# Altium schematic sheet ME2_LNA.SchDoc
size A; SheetNumber: 1; SheetTotal: 1
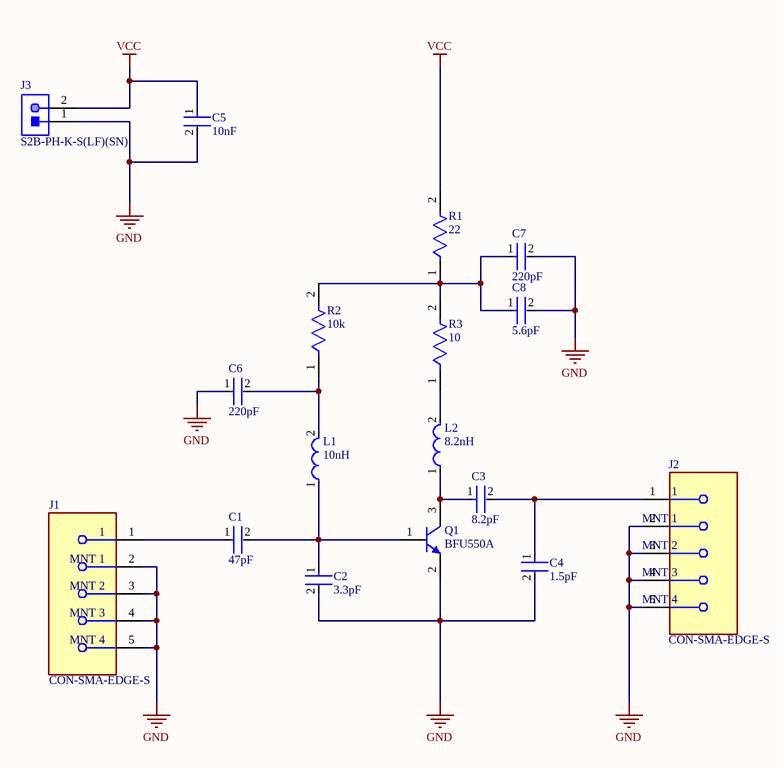
[diagram p0: ME2_LNA.SchDoc]

## Parts
C1  47pF  [FP-GCM188-0_1-MFG]
C2  3.3pF  [FP-GCM188-0_1-MFG]
C3  8.2pF  [FP-GCM188-0_1-MFG]
C4  1.5pF  [FP-GCM188-0_1-MFG]
C5  10nF  [FP-C0603C-CF-MFG]
C6  220pF  [FP-GCM188-0_1-MFG]
C7  220pF  [FP-GCM188-0_1-MFG]
C8  5.6pF  [FP-GCM188-0_1-MFG]
J1  CON-SMA-EDGE-S  [FP-CON-SMA-EDGE-S-MFG]
J2  CON-SMA-EDGE-S  [FP-CON-SMA-EDGE-S-MFG]
J3  S2B-PH-K-S(LF)(SN)  [JST-S2B-PH-K-S_V]
L1  10nH  [FP-LQW18AN_00-MFG]
L2  8.2nH  [FP-LQW18AN_00-MFG]
Q1  BFU550A  [ONSC-SOT-23-3-318-08_V]
R1  22  [FP-CRCW0603-e3-MFG]
R2  10k  [FP-CRCW0603-HPe3-MFG]
R3  10  [FP-CRCW0603-e3-MFG]

## Nets
GND: C2.2 C4.2 C5.2 C6.1 C7.2 C8.2 J1.2(MNT_1) J1.3(MNT_2) J1.4(MNT_3) J1.5(MNT_4) J2.2(MNT_1) J2.3(MNT_2) J2.4(MNT_3) J2.5(MNT_4) J3.1 Q1.2(E)
VCC: C5.1 J3.2 R1.2
NetC1_1: C1.1 J1.1
NetC1_2: C1.2 C2.1 L1.1 Q1.1(B)
NetC3_1: C3.1 L2.1 Q1.3(C)
NetC3_2: C3.2 C4.1 J2.1
NetC6_2: C6.2 L1.2 R2.1
NetC7_1: C7.1 C8.1 R1.1 R2.2 R3.2
NetL2_2: L2.2 R3.1

## Library data of the parts
C1 = CMP-06035-035791-1: Ceramic Capacitor for Automotive 47pF  ±1% 100VDC C0G 0603 Paper T/R / GCM1885C2A470FA16D; Voltage Rating: 100V; Ratings: AEC-Q200; Case Code (Metric): 1608; Case Code (Imperial): 0603; Capacitance: 47pF; Min Operating Temperature: -55°C; Case/Package: 0603; Tolerance: 1%; Packaging: Cut Tape; Max Operating Temperature: 125°C; Mount: Surface Mount
C2 = CMP-06035-045493-1: Ceramic Capacitor for Automotive 3.3pF  ±0.25pF 100VDC C0G 0603 Paper T/R / GCM1885C2A3R3CA16D; Voltage Rating (DC): 100V; Max Operating Temperature: 125°C; Height: 0.8mm; Package Quantity: 4000; Weight: 0.000222oz; Width: 0.8mm; Case Code (Imperial): 0603; Thickness: 0.035inch; Case Code (Metric): 1608; Length: 0.063inch; Packaging: Tape and Reel; Termination: SMD/SMT; Ratings: AEC-Q200; Mount: Surface Mount; Case/Package: 0603; Capacitance: 3.3pF; Dielectric: C0G; Voltage Rating: 100V; Min Operating Temperature: -55°C
C3 = CMP-06035-009251-1: Ceramic Capacitor for Automotive 8.2pF  ±0.25pF 100VDC C0G 0603 Paper T/R / GCM1885C2A8R2CA16D
C4 = CMP-06035-055355-1: Ceramic Capacitor for Automotive 1.5pF  ±0.25pF 100VDC C0G 0603 Paper T/R / GCM1885C2A1R5CA16D; Voltage Rating (DC): 100V; Thickness: 0.035inch; Packaging: Tape and Reel; Weight: 0.000222oz; Length: 0.063inch; Min Operating Temperature: -55°C; Case/Package: 0603; Termination: SMD/SMT; Package Quantity: 4000; Case Code (Metric): 1608; Ratings: AEC-Q200; Max Operating Temperature: 125°C; Height: 0.8mm; Case Code (Imperial): 0603; Capacitance: 1.5pF; Mount: Surface Mount; Dielectric: C0G; Width: 0.8mm; Voltage Rating: 100V
C5 = CMP-2006-03038-2: CAP CER 10000PF 200V X7R 0603 / C0603C103K2RACTU; Manufacturer: KEMET; Material: Ceramic; Value: 10,000 pF; Temperature Coefficient: 30ppm/°C; Tolerance: 0.1; Automotive Grade: Grade 1; Voltage Rating: 200 V; Manufacturer Part Number: C0603C103K2RACTU; ComponentLink2Description: Datasheet; Package: C0603C-CF; Device Class L2: Capacitors; Mouser Description: Multilayer Ceramic Capacitors MLCC - SMD/SMT 200volts 10000pF X7R 10%; Device Class L3: Ceramic Capacitors; Temperature Range Low: -55°C; Category: Cap; Device Class L1: Passive Components; Lead Free: Yes; Octopart: https://octopart.com/c0603c103k2ractu-kemet-1061947; ComponentLink2URL: https://api.kemet.com/component-edge/download/datasheet/C0603C100J5GACAUTO.pdf; Temperature Characteristic: X7R; Temperature: -55°C to +125°C; Automotive: Yes; Temperature Range High: +125°C; Digikey Description: CAP CER 10000PF 200V X7R 0603; Height: 0.87mm; RoHS: TRUE; Capacitance: 10,000 pF
C6 = CMP-06035-009189-1: Ceramic Capacitor for Automotive 220pF  ±1% 100VDC C0G 0603 Paper T/R / GCM1885C2A221FA16D; Voltage Rating: 100V; Min Operating Temperature: -55°C; Ratings: AEC-Q200; Mount: Surface Mount; Max Operating Temperature: 125°C; Case Code (Imperial): 0603; Case/Package: 0603; Tolerance: 1%; Packaging: Tape and Reel; Case Code (Metric): 1608; Capacitance: 220pF
C7 = CMP-06035-009189-1: Ceramic Capacitor for Automotive 220pF  ±1% 100VDC C0G 0603 Paper T/R / GCM1885C2A221FA16D Murata; Voltage Rating: 100V; Min Operating Temperature: -55°C; Ratings: AEC-Q200; Mount: Surface Mount; Max Operating Temperature: 125°C; Case Code (Imperial): 0603; Case/Package: 0603; Tolerance: 1%; Packaging: Tape and Reel; Case Code (Metric): 1608; Capacitance: 220pF
C8 = CMP-06035-009093-1: Ceramic Capacitor for Automotive 5.6pF  ±0.25pF 100VDC C0G 0603 Paper T/R / GCM1885C2A5R6CA16D
J1 J2 = CMP-204357-000001-1: CONN SMA JACK STR EDGE MNT; Manufacturer: RF Solutions Ltd.; Impedance: 50Ω; Conn Orientation: Right Angle; Is Female: yes; Number Of Contacts: 1; Frequency: 18GHz; Shielding: true; Category: Conn; ComponentLink2URL: https://www.rfsolutions.co.uk/downloads/1498648656DS-CON-EDGE-SMA-4.pdf; Octopart: https://octopart.com/con-sma-edge-s-rf+solutions-70967450; Package: CONN_JACK; Manufacturer Part Number: CON-SMA-EDGE-S; Height: 6.35mm; Device Class L1: Connectors; Footprint Url: https://forum.upverter.com/uploads/default/original/3X/b/e/be75b907af57498775929d6d9099689c472e0307.pdf; Contact Material: Gold; ComponentLink2Description: Datasheet; Device Class L2: RF / Coaxial Connectors; RoHS: TRUE; Device Class L3: unset; Digikey Description: CONN SMA JACK STR EDGE MNT; Lead Free: Yes; Automotive: No
J3 = CMP-1755-00004-1: Male Header, Pitch 2 mm, 1 x 2 Position, Height 4.8 mm, Tail Length 3.4 mm, -25 to 85 degC, RoHS, Bulk; Case\Package: Radial; Tolerance: 20%; Capacitance: 10 uF; Voltage Rating (DC): 50 V; Packaging: Bulk; ComponentLink1URL: http://www.jst-mfg.com/product/pdf/eng/ePH.pdf; Radiation Hardening: No; Height: 11 mm; Package Quantity: 200; PackageDescription: Male Header, Pitch 2 mm, 1 x 2 Position, Height 4.8 mm, Tail Length 3.4 mm; PackageReference: S2B-PH-K-S; Diameter: 5 mm; Pins: 2; Mount: Through Hole; Max Operating Temperature: 85 degC; Min Operating Temperature: -40 degC; ComponentLink1Description: Datasheet; DatasheetVersion: Dec-12; Length: 11 mm; Lead Pitch: 2 mm; REACH SVHC: No SVHC; Voltage Rating: 50 V; RoHSCompliant: true
L1 = CMP-2000-06599-2: Wire Wound RF Inductor 10nH ±2% 650mA 0.11Ω 0603 (1608) / LQW18AN10NG00D Murata; DC Resistance (DCR): 110mR; Q Factor: 35; Shielding: Unshielded; Test Frequency: 100MHz; Current: 550mA; Self Resonant Frequency: 6GHz; Radiation Hardening: No; Depth: 1mm; Case Code (Imperial): 0603; Inductance: 10nH; Inductance Tolerance: 2%; Series: LQW18A_00; Tolerance: 2%; Weight: 0.000106oz; Rated Current-Max: 650mA; Mount: Surface Mount; Series Resistance: 110mR; REACH SVHC: No SVHC; Current Rating: 650mA; Case Code (Metric): 1608; Lead Free: Lead Free; Resistor Type: Wirewound; Package Quantity: 4000; Termination: SMD/SMT; DC Current: 650mA; Height: 0.8mm; Min Operating Temperature: -55°C; Military Standard: Not; Max Operating Temperature: 125°C; Max DC Current: 650mA; Case/Package: 0603; Number of Pins: 2; Packaging: Tape and Reel; Width: 0.8mm; Length: 1.6mm
L2 = CMP-06042-007631-1: Wire Wound RF Inductor 8.2nH ±0.5nH 650mA 0.11Ω 0603 (1608) / LQW18AN8N2D00D Murata; Core Material: Non-Magnetic; Shielding: Unshielded; Test Frequency: 100MHz; DC Resistance (DCR): 110mR; Self Resonant Frequency: 6GHz; Q Factor: 35; Packaging: Tape and Reel; Case/Package: 0603; Lead Free: Lead Free; Case Code (Metric): 1608; Height - Seated (Max): 0.039inch; Width: 0.031inch; Min Operating Temperature: -55°C; Mount: Surface Mount; Military Standard: Not; Height: 0.8mm; Radiation Hardening: No; Length: 1.6mm; Case Code (Imperial): 0603; Max DC Current: 650mA; Series Resistance: 110mR; Current Rating: 650mA; Package Quantity: 4000; Depth: 1mm; Inductance: 8.2nH; Resistor Type: Wirewound; Weight: 0.000106oz; Max Operating Temperature: 125°C; DC Current: 650mA; Termination: SMD/SMT
Q1 = BFU550A: BFU550A / NPN wideband silicon RF transistor; Manufacturer: On Semiconductor; PartNumber: MMBTH10LT1G; Packing: Tape and Reel; fT Min (MHz): 650; ComponentLink1Description: Manufacturer URL; PackageVersion: Rev. AP, 11/2009; RoHS: TRUE; ComponentLink2URL: http://www.onsemi.cn/pub_link/Collateral/MMBTH10LT1-D.PDF; ComponentLink3URL: http://www.onsemi.cn/pub_link/Collateral/318-08.PDF; DatasheetVersion: Rev. 5; ComponentLink3Description: Package Specification; PackageReference: SOT-23-3-318-08; Mounting Technology: Surface Mount; ComponentLink1URL: http://www.onsemi.com/; Polarity: NPN; PackageDescription: 3-Pin Small Outline Transistor, Body 2.92 x 1.3 mm, Pitch 0.95 mm; ComponentLink2Description: Datasheet
R1 = CMP-2000-03097-2: RES Thick Film, 22Ω, 1%, 0.1W, 100ppm/°C, 0603 / CRCW060322R0FKEA Vishay; Voltage Rating: 75V; Power Rating: 100mW; Resistance: 22R; Lead Free: Lead Free; Height: 0.45mm; Package Quantity: 5000; Weight: 7.1E-05oz; Width: 0.85mm; Length: 1.55mm; Mount: Surface Mount; Packaging: Tape and Reel; Termination: SMD/SMT; Temperature Coefficient: 100ppm/°C; Case/Package: 0603; Case Code (Metric): 1608; Radiation Hardening: No; Max Operating Temperature: 155°C; Military Standard: Not; Min Operating Temperature: -55°C; Case Code (Imperial): 0603; Contact Plating: Tin; Voltage Rating (DC): 75V; Tolerance: 1%; Depth: 0.85mm; Composition: Thick Film
R2 = CMP-2000-03835-2: RES SMD 10K OHM 1% 1/3W 0603 / CRCW060310K0FKEAHP Vishay; Resistance: 10kR; Voltage Rating (DC): 75V; Max Power Dissipation: 250mW; Temperature Coefficient: 100ppm/°C; Case Code (Metric): 1608; Features: Automotive AEC-Q200; Termination: SMD/SMT; Number of Terminations: 2; Case Code (Imperial): 0603; Tolerance: 1%; Depth: 0.85mm; Package Quantity: 10; Length: 1.6mm; Packaging: Tape and Reel; Contact Plating: Tin; Radiation Hardening: No; Case/Package: 0603; Composition: Thick Film; Voltage Rating: 75V; Weight: 7.1E-05oz; Max Operating Temperature: 155°C; Lead Free: Lead Free; Width: 0.033inch; Power Rating: 250mW; Min Operating Temperature: -55°C; Military Standard: Not; Height: 0.45mm
R3 = CMP-2000-03845-2: RES Thick Film, 10Ω, 1%, 0.1W, 100ppm/°C, 0603 / CRCW060310R0FKEA Vishay; Resistance: 10R; Voltage Rating (DC): 75V; Power Rating: 100mW; Depth: 0.85mm; Height: 0.45mm; Package Quantity: 10; Temperature Coefficient: 100ppm/°C; Weight: 7.1E-05oz; Case Code (Metric): 1608; Number of Terminations: 2; Features: Automotive AEC-Q200; Termination: SMD/SMT; Lead Free: Lead Free; Mount: Surface Mount; Number of Pins: 2; Tolerance: 1%; Max Power Dissipation: 100mW; Width: 0.033inch; Contact Plating: Tin; Case Code (Imperial): 0603; Max Operating Temperature: 155°C; Min Operating Temperature: -55°C; Voltage Rating: 75V; Length: 1.55mm; Case/Package: 0603; Composition: Thick Film; Packaging: Tape and Reel; Military Standard: Not